# EAGLE design controller_board (EAGLE 7.2.0)
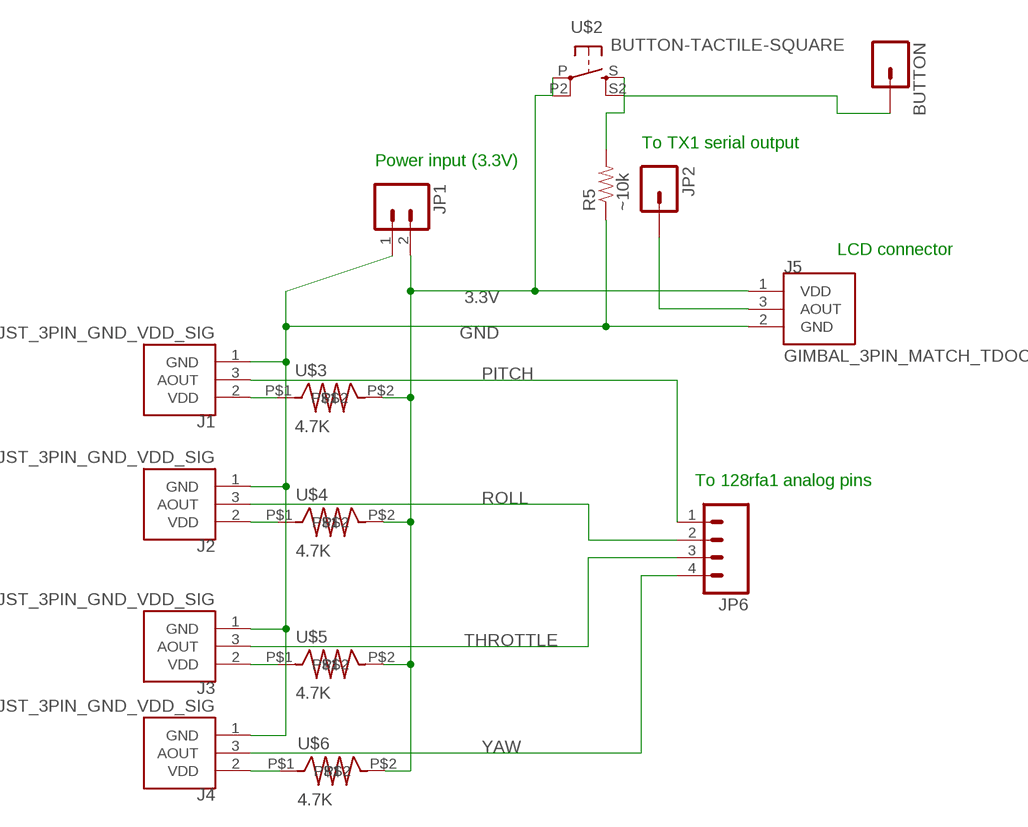
[diagram p0: schematic, sheet 1]

## Parts
BUTTON  M01PTH  [1X01]
J1  JST_3PIN_GND_VDD_SIG  [JST-3-PTH-REVERSE]
J2  JST_3PIN_GND_VDD_SIG  [JST-3-PTH-REVERSE]
J3  JST_3PIN_GND_VDD_SIG  [JST-3-PTH-REVERSE]
J4  JST_3PIN_GND_VDD_SIG  [JST-3-PTH-REVERSE]
J5  GIMBAL_3PIN_MATCH_TDOCU  [JST-3-PTH]
JP1  M021X02_NO_SILK  [1X02_NO_SILK]
JP2  M01PTH  [1X01]
JP6  M04PTH  [1X04]
R5  ~10k  RESISTORPTH-1/4W  [AXIAL-0.4]
U$2  BUTTON-TACTILE-SQUARE  [BUTTON-TACTILE-SQUARE-ADAFRUIT1010]
U$3  4.7K  CRF12_RESISTOR  [CRF12_RESISTOR]
U$4  4.7K  CRF12_RESISTOR  [CRF12_RESISTOR]
U$5  4.7K  CRF12_RESISTOR  [CRF12_RESISTOR]
U$6  4.7K  CRF12_RESISTOR  [CRF12_RESISTOR]

## Nets
3.3V: J5.1(VDD) JP1.2 U$2.P U$2.P2(P1) U$3.P$2 U$4.P$2 U$5.P$2 U$6.P$2
GND: J1.1(GND) J2.1(GND) J3.1(GND) J4.1(GND) J5.2(GND) JP1.1 R5.P$1
N$1: J1.2(VDD) U$3.P$1
N$2: J2.2(VDD) U$4.P$1
N$3: J3.2(VDD) U$5.P$1
N$4: J4.2(VDD) U$6.P$1
N$6: BUTTON.1 R5.P$2 U$2.S U$2.S2(S1)
N$9: J5.3(AOUT) JP2.1
PITCH: J1.3(AOUT) JP6.1
ROLL: J2.3(AOUT) JP6.2
THROTTLE: J3.3(AOUT) JP6.3
YAW: J4.3(AOUT) JP6.4

## Notes on the sheet
- To TX1 serial output
- Power input (3.3V)
- LCD connector
- To 128rfa1 analog pins

## Library data of the parts
BUTTON JP2 = SparkFun-Connectors:M01: Header 1 Standard 1-pin 0.1" header. Use with straight break away headers (SKU : PRT-00116), right angle break away headers (PRT-00553), swiss pins (PRT-00743), machine pins (PRT-00117), and female headers (PRT-00115).
J1-J4 = Controller:JST_3PIN_GND_VDD_SIG
J5 = Controller:GIMBAL_3PIN_MATCH_TDOCU
JP1 = SparkFun-Connectors:M02: Standard 2-pin 0.1" header. Use with - straight break away headers ( PRT-00116) - right angle break away headers (PRT-00553) - swiss pins (PRT-00743) - machine pins (PRT-00117) - female headers (PRT-00115) Molex polarized connector foot print use with: PRT-08233 with associated crimp pins and housings. 2.54_SCREWTERM for use with PRT-10571. 3.5mm Screw Terminal footprints for PRT-08084 5mm Screw Terminal footprints for use with PRT-08432
JP6 = SparkFun-Connectors:M04: Header 4 Standard 4-pin 0.1" header. Use with straight break away headers (SKU : PRT-00116), right angle break away headers (PRT-00553), swiss pins (PRT-00743), machine pins (PRT-00117), and female headers (PRT-00115). Molex polarized connector foot print use with SKU : PRT-08231 with associated crimp pins and housings. 1MM SMD Version SKU: PRT-10208
R5 = SparkFun-Resistors:RESISTOR: Resistor Basic schematic elements and footprints for 0603, 1206, and PTH resistors.
U$2 = Controller:BUTTON-TACTILE
U$3-U$6 = Lab4:CRF12_RESISTOR; CREATOR: David Smith; DIST: Digikey; DISTPN: 4.7KEBK-ND; TOL: 5%

## Board
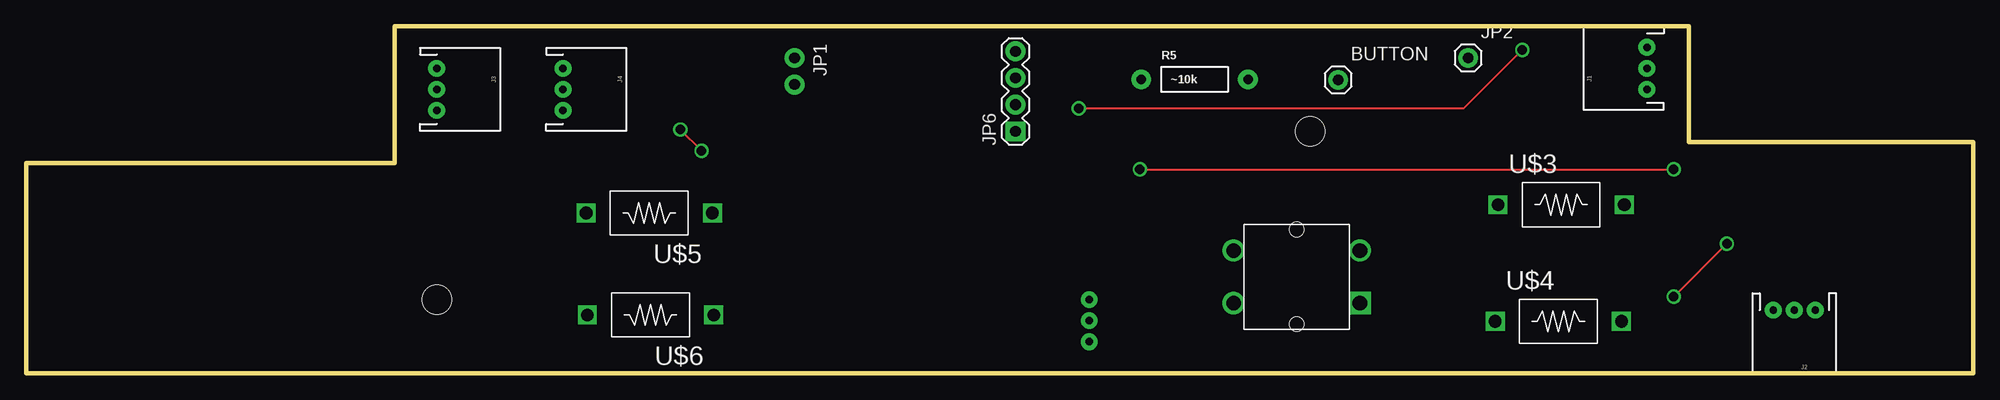
[diagram p1: board, top side]
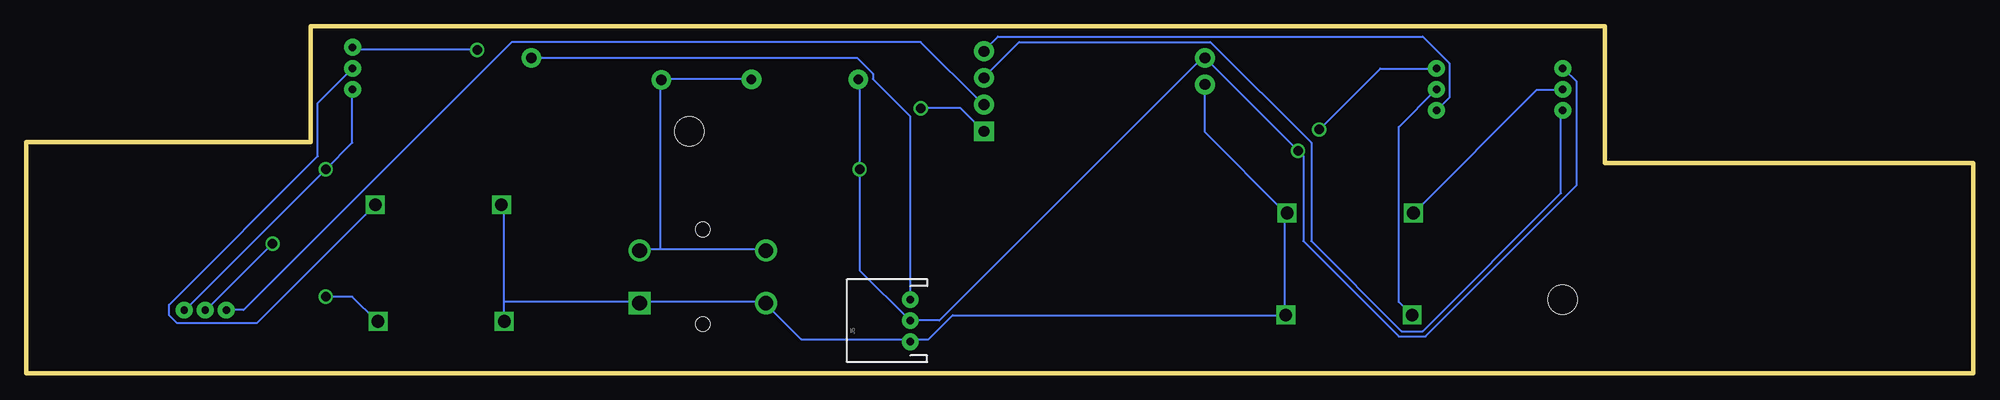
[diagram p2: board, bottom side, seen from below]

Size 185 x 33 mm. Coordinates in mm from the lower left corner, seen from the top.
Outline: 158,22 158,33 35,33 35,20 0,20 0,0 185,0 185,22 158,22
Copper layers (1*16): Top 0.035559375mm / dielectric 1.501140625mm / Bottom 0.035559375mm
Design rules "4pcb-33board *": minimum track width 0.2mm, minimum drill 0.9mm, track to track 12mil, track to pad 12mil, pad to pad 12mil, via to via 12mil, smd to smd 12mil, copper to edge 10mil, drill to drill 10mil, minimum pad ring 10mil, minimum via ring 8mil, stop-mask expansion 4mil, vias tented up to drill 0mil, thermal gap 10mil
tRestrict: area 37,22.6 to 45.3,31.5; area 48.8,22.6 to 57.1,31.5; area 163.5,0 to 172.4,8.3; area 99.1,0.6 to 107.4,9.4; area 147.6,24.5 to 155.8,33.3; area 70.4,25.5 to 75.6,32; area 91,21.1 to 96.9,32.5; area 122.2,25.5 to 127.2,30.3; area 135,27.9 to 138.9,31.8; area 113,1.8 to 128.6,16.5; area 51.4,13.3 to 54.7,17.1; area 63.4,13.4 to 66.8,17.1; 8 more areas
vRestrict: area 35.3,18.8 to 61.3,32.8; area 48.8,0.1 to 69.2,19.9; area 66.6,21.1 to 79,32.9; area 88.4,18.8 to 99.3,32.8; area 102.6,23.5 to 119.3,31.8; area 120,22.9 to 129.5,32.5; area 133.7,26.1 to 140.5,32.9; area 144.5,20.9 to 158,33; area 135.6,0.1 to 155.7,21.2; area 160.2,-0.1 to 175.4,11.5; area 109.3,0 to 132.5,19.2; area 95.8,0 to 109.9,13.2

### Footprints (pad centres in the part's own frame; a part is rotated, then mirrored left to right if it is on the bottom)
1X01 = drill 1.016 pad 1.88: 1 0,0
JST-3-PTH-REVERSE = drill 0.7 pad 1.6: 1 -2,0; 2 0,0; 3 2,0
JST-3-PTH = drill 0.7 pad 1.6: 1 -2,0; 2 0,0; 3 2,0
1X02_NO_SILK = drill 1.016 pad 1.88: 1 0,0; 2 2.54,0
1X04 = drill 1.016 pad 1.88 square: 1 0,0 | drill 1.016 pad 1.88: 2 2.54,0; 3 5.08,0; 4 7.62,0
AXIAL-0.4 = drill 0.9 pad 1.88: P$1 -5.08,0; P$2 5.08,0
CONNECTOR_BOARD_OUTLINE = hole 2.8: 154,45; 71,29
BUTTON-TACTILE-SQUARE-ADAFRUIT1010 = drill 1.4 square: P -6,2.5 | drill 1.4: P2 6,2.5; S -6,-2.5; S2 6,-2.5 | hole 1.4: 0,-4.5; 0,4.5
CRF12_RESISTOR = drill 1.2 square: P$1 6,0; P$2 -6,0

### Placement (x,y rotation side)
BUTTON  124.66,27.9 0 top
J1  154,29 90 top
J2  168,6 180 top
J3  39,27 270 top
J4  51,27 270 top
J5  101,5 90 bottom
JP1  73,30 270 top
JP2  137,30 0 top
JP6  94,23 90 top
R5  111.01,27.94 0 top
U$1  [CONNECTOR_BOARD_OUTLINE]  -32,-22 0 top
U$2  120.72,9.17 180 top
U$3  145.84,16.03 0 top
U$4  145.58,4.93 0 top
U$5  59.19,15.24 180 top
U$6  59.31,5.55 180 top

### Tracks (layer width: path | path; a pad name or v marks a point on that pad's centre or on a via)
3.3V
  Bottom 0.2: JP1.2 73,27.22 73,22.93 65.43,15.35 U$5.P$2 65.43,15.1 65.43,5.76 U$6.P$2 65.43,5.51 96.98,5.51 99.25,3.24 100.76,3.24 J5.1 101.01,3.24 111.36,3.24 114.64,6.52 U$2.P2 114.9,6.77 126.51,6.77 U$2.P 126.76,6.77 139.63,6.77 | 139.63,6.77 139.63,15.86 U$3.P$2 | 139.63,6.77 139.63,5.01 U$4.P$2
GND  (via drill 0.9)
  Top 0.2: v64.16,21.16 v62.14,23.18 | v105.81,19.39 v156.54,19.39
  Bottom 0.2: J1.1 154.02,26.97 154.02,21.92 v156.54,19.39 169.92,6.02 J2.1 | R5.P$1 105.81,27.72 v105.81,19.39 105.81,9.8 101.01,5.01 J5.2 100.76,5.01 98.24,5.01 73.25,29.99 JP1.1 v64.16,21.16 63.66,20.66 63.66,12.58 54.57,3.49 52.05,3.49 37.66,17.88 37.66,27.72 38.92,28.98 J3.1 | v62.14,23.18 56.34,28.98 51.04,28.98 J4.1
N$1
  Bottom 0.2: J1.2 154.02,28.98 157.3,25.7 157.3,20.66 171.43,6.52 171.43,5.51 170.68,4.75 163.1,4.75 152,15.86 U$3.P$1
N$2  (via drill 0.9)
  Top 0.2: v156.54,7.28 v161.59,12.33
  Bottom 0.2: v161.59,12.33 167.9,6.02 J2.2 | v156.54,7.28 154.02,7.28 151.75,5.01 U$4.P$1
N$3
  Bottom 0.2: J3.2 39.18,26.97 41.45,26.97 53.06,15.35 U$5.P$1
N$4
  Bottom 0.2: J4.2 51.04,26.97 54.57,23.43 54.57,6.77 53.56,5.76 U$6.P$1
N$6
  Bottom 0.2: R5.P$2 116.16,27.98 124.49,27.98 BUTTON.1 124.74,27.72 124.74,11.82 | 124.74,11.82 126.51,11.82 U$2.S | 124.74,11.82 114.9,11.82 U$2.S2
N$9
  Bottom 0.2: J5.3 101.01,7.03 101.01,24.44 104.55,27.98 104.55,28.48 106.06,29.99 136.86,29.99 JP2.1
PITCH  (via drill 0.9)
  Top 0.2: v142.16,30.75 136.6,25.2 v100,25.2
  Bottom 0.2: v142.16,30.75 153.77,30.75 J1.3 | v100,25.2 96.22,25.2 94.2,23.18 JP6.1
ROLL
  Bottom 0.2: J2.3 165.88,6.02 164.37,6.02 138.88,31.51 100,31.51 94.2,25.7 JP6.2
THROTTLE
  Bottom 0.2: J3.3 39.18,24.95 39.18,17.12 52.3,4 54.32,4 62.9,12.58 62.9,21.92 72.49,31.51 90.67,31.51 93.95,28.23 JP6.3
YAW
  Bottom 0.2: J4.3 50.79,25.2 49.78,26.21 49.78,29.49 52.3,32.01 92.69,32.01 93.95,30.75 JP6.4